# EAGLE design ppm_encoder_402 (EAGLE 5.03)
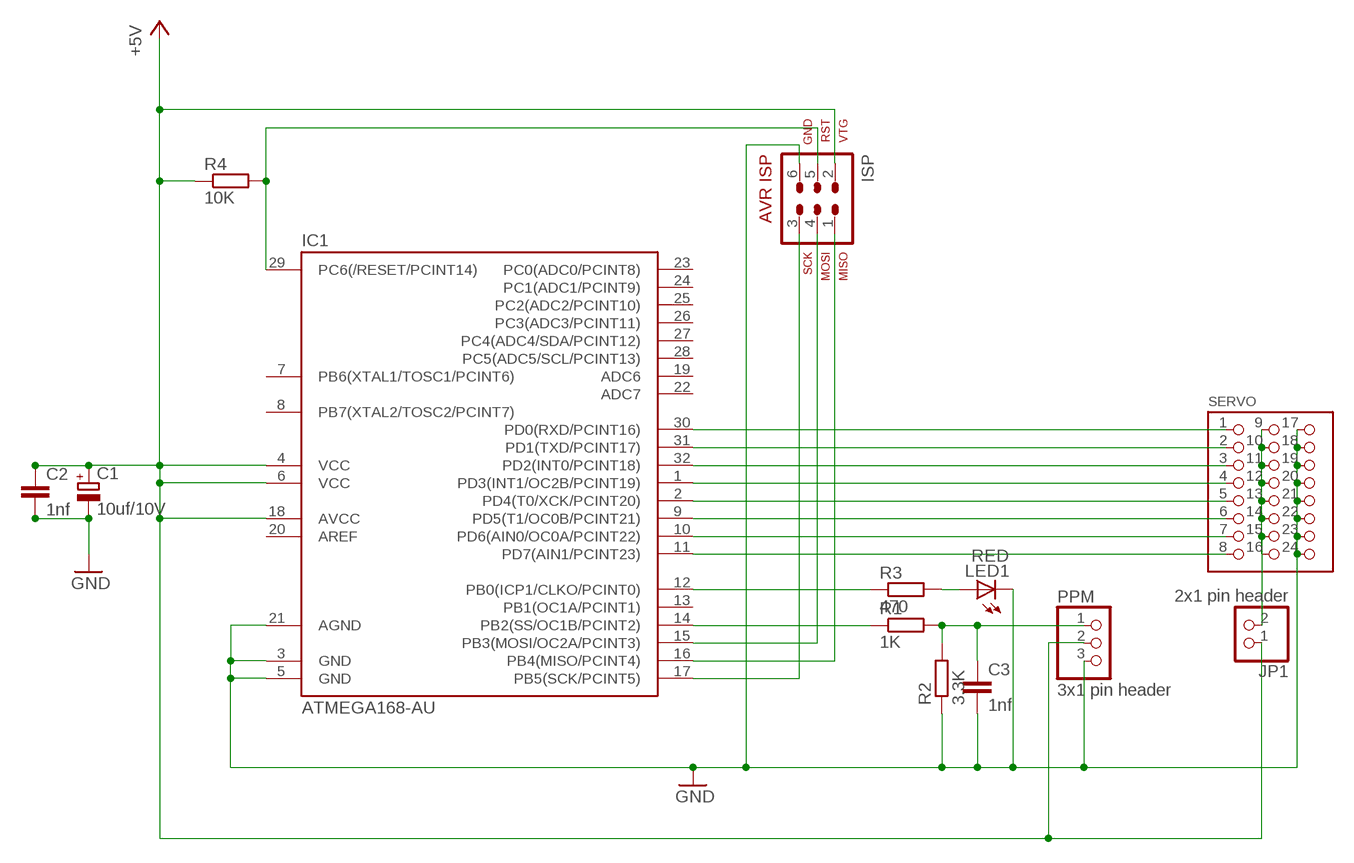
[diagram p0: schematic, sheet 1]

## Parts
C1  10uf/10V  CPOL-EUB/3528-21R  [B/3528-21R]
C2  1nf  C-EUC0402  [C0402]
C3  1nf  C-EUC0402  [C0402]
IC1  ATMEGA168-AU  MEGA48/88/168-AU  [TQFP32-08]
ISP  AVR-ISP-6  [AVR-ISP-6]
JP1  2x1 pin header  PINHD-1X2  [1X02]
LED1  RED  LEDCHIP-LED0603  [CHIP-LED0603]
PPM  3x1 pin header  PINHD-1X3  [1X03]
R1  1K  R-EU_R0402  [R0402]
R2  3.3K  R-EU_R0402  [R0402]
R3  470  R-EU_R0402  [R0402]
R4  10K  R-EU_R0402  [R0402]
SERVO  3x8 pin header  PIN_3X8  [PIN_3X8]

## Nets
+5V: C1.+ C2.1 IC1.4(VCC) IC1.6(VCC) IC1.18(AVCC) ISP.2 JP1.1 PPM.2 R4.1
GND: C1.- C2.2 C3.2 IC1.3(GND) IC1.5(GND) IC1.21(AGND) ISP.6 LED1.C PPM.3 R2.1 SERVO.17 SERVO.18 SERVO.19 SERVO.20 SERVO.21 SERVO.22 SERVO.23 SERVO.24
N$1: IC1.30(PD0(RXD/PCINT16)) SERVO.1
N$2: IC1.31(PD1(TXD/PCINT17)) SERVO.2
N$3: IC1.32(PD2(INT0/PCINT18)) SERVO.3
N$4: IC1.1(PD3(INT1/OC2B/PCINT19)) SERVO.4
N$5: IC1.2(PD4(T0/XCK/PCINT20)) SERVO.5
N$6: IC1.9(PD5(T1/OC0B/PCINT21)) SERVO.6
N$7: IC1.10(PD6(AIN0/OC0A/PCINT22)) SERVO.7
N$8: IC1.11(PD7(AIN1/PCINT23)) SERVO.8
N$9: IC1.12(PB0(ICP1/CLKO/PCINT0)) R3.1
N$10: IC1.14(PB2(SS/OC1B/PCINT2)) R1.1
N$11: C3.1 PPM.1 R1.2 R2.2
N$12: LED1.A R3.2
N$13: IC1.16(PB4(MISO/PCINT4)) ISP.1
N$14: IC1.15(PB3(MOSI/OC2A/PCINT3)) ISP.4
N$15: IC1.17(PB5(SCK/PCINT5)) ISP.3
N$16: IC1.29(PC6(/RESET/PCINT14)) ISP.5 R4.2
N$18: JP1.2 SERVO.9 SERVO.10 SERVO.11 SERVO.12 SERVO.13 SERVO.14 SERVO.15 SERVO.16
Unconnected: IC1.7(PB6(XTAL1/TOSC1/PCINT6)) IC1.8(PB7(XTAL2/TOSC2/PCINT7)) IC1.13(PB1(OC1A/PCINT1)) IC1.19(ADC6) IC1.20(AREF) IC1.22(ADC7) IC1.23(PC0(ADC0/PCINT8)) IC1.24(PC1(ADC1/PCINT9)) IC1.25(PC2(ADC2/PCINT10)) IC1.26(PC3(ADC3/PCINT11)) IC1.27(PC4(ADC4/SDA/PCINT12)) IC1.28(PC5(ADC5/SCL/PCINT13))

## Library data of the parts
C1 = rcl:CPOL-EU: POLARIZED CAPACITOR, European symbol
C2 C3 = rcl:C-EU: CAPACITOR, European symbol
IC1 = avr-4:MEGA48/88/168
ISP = avr-4:AVR-ISP-6: AVR ISP-6 Serial Programming Header
JP1 = pinhead:PINHD-1X2: PIN HEADER
LED1 = led:LED: LED OSRAM: - CHIPLED LG R971, LG N971, LY N971, LG Q971, LY Q971, LO R971, LY R971 LH N974, LH R974 LS Q976, LO Q976, LY Q976 LO Q996 - Hyper CHIPLED LW Q18S LB Q993, LB Q99A, LB R99A - SideLED LS A670, LO A670, LY A670, LG A670, LP A670 LB A673, LV A673, LT A673, LW A673 LH A674 LY A675 LS A676, LA A676, LO A676, LY A676, LW A676 LS A679, LY A679, LG A679 - Hyper Micro SIDELED® LS Y876, LA Y876, LO Y876, LY Y876 LT Y87S - SmartLED LW L88C, LW L88S LB L89C, LB L89S, LG L890 LS L89K, LO L89K, LY L89K LS L896, LA L896, LO L896, LY L896 - TOPLED LS T670, LO T670, LY T670, LG T670, LP T670 LSG T670, LSP T670, LSY T670, LOP T670, LYG T670 LG T671, LOG T671, LSG T671 LB T673, LV T673, LT T673, LW T673 LH T674 LS T676, LA T676, LO T676, LY T676, LB T676, LH T676, LSB T676, LW T676 LB T67C, LV T67C, LT T67C, LS T67K, LO T67K, LY T67K, LW E67C LS E67B, LA E67B, LO E67B, LY E67B, LB E67C, LV E67C, LT E67C LW T67C LS T679, LY T679, LG T679 LS T770, LO T770, LY T770, LG T770, LP T770 LB T773, LV T773, LT T773, LW T773 LH T774 LS E675, LA E675, LY E675, LS T675 LS T776, LA T776, LO T776, LY T776, LB T776 LHGB T686 LT T68C, LB T68C - Hyper Mini TOPLED® LB M676 - Mini TOPLED Santana® LG M470 LS M47K, LO M47K, LY M47K Source: http://www.osram.convergy.de LUXEON: - LUMILED® LXK2-PW12-R00, LXK2-PW12-S00, LXK2-PW14-U00, LXK2-PW14-V00 LXK2-PM12-R00, LXK2-PM12-S00, LXK2-PM14-U00 LXK2-PE12-Q00, LXK2-PE12-R00, LXK2-PE12-S00, LXK2-PE14-T00, LXK2-PE14-U00 LXK2-PB12-K00, LXK2-PB12-L00, LXK2-PB12-M00, LXK2-PB14-N00, LXK2-PB14-P00, LXK2-PB14-Q00 LXK2-PR12-L00, LXK2-PR12-M00, LXK2-PR14-Q00, LXK2-PR14-R00 LXK2-PD12-Q00, LXK2-PD12-R00, LXK2-PD12-S00 LXK2-PH12-R00, LXK2-PH12-S00 LXK2-PL12-P00, LXK2-PL12-Q00, LXK2-PL12-R00 Source: www.luxeon.com KINGBRIGHT: KA-3528ASYC Source: www.kingbright.com
PPM = pinhead:PINHD-1X3: PIN HEADER
R1-R4 = rcl:R-EU_: RESISTOR, European symbol
SERVO = pinhead_3row:PIN_3X8

## Board
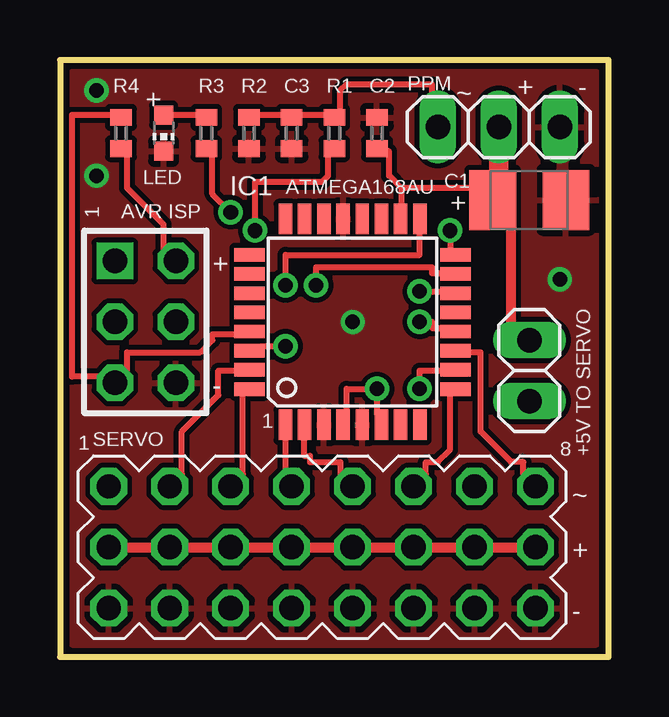
[diagram p1: board, top side]
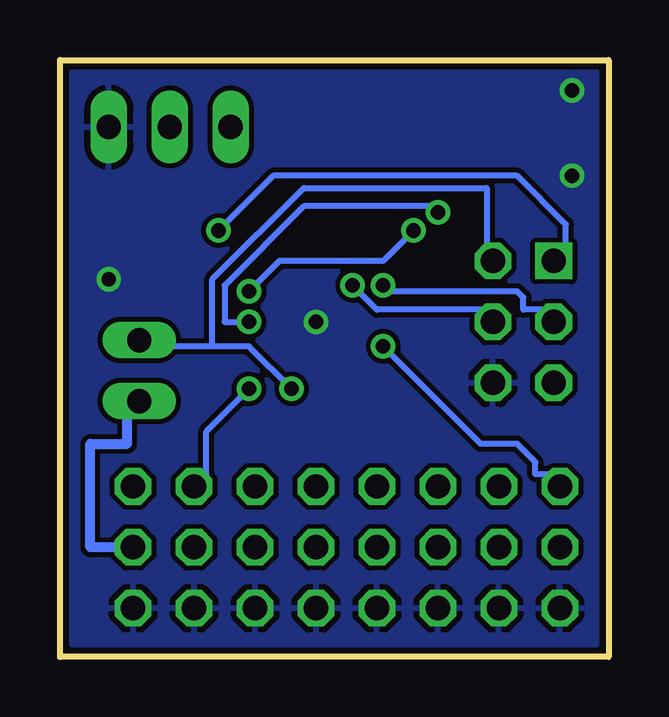
[diagram p2: board, bottom side, seen from below]

Size 22.86 x 24.89 mm. Coordinates in mm from the lower left corner, seen from the top.
Outline: 0,0 22.86,0 22.86,24.89 0,24.89 0,0
Copper layers (1*16): Top 0.035mm / dielectric 1.5mm / Bottom 0.035mm
Design rules "default *": minimum track width 8mil, minimum drill 24mil, track to track 8mil, track to pad 8mil, pad to pad 8mil, via to via 8mil, smd to smd 8mil, copper to edge 8mil, drill to drill 8mil, minimum pad ring 10mil, minimum via ring 8mil, stop-mask expansion 4mil, vias tented up to drill 0mil, thermal gap 10mil

### Footprints (pad centres in the part's own frame; a part is rotated, then mirrored left to right if it is on the bottom)
B/3528-21R = smd 1.95 x 2.5: + 1.525,0; - -1.525,0
C0402 = smd 0.7 x 0.9: 1 -0.65,0; 2 0.65,0
TQFP32-08 = smd 1.27 x 0.559: 1 -4.293,2.8; 2 -4.293,2; 3 -4.293,1.2; 4 -4.293,0.4; 5 -4.293,-0.4; 6 -4.293,-1.2; 7 -4.293,-2; 8 -4.293,-2.8; 17 4.293,-2.8; 18 4.293,-2; 19 4.293,-1.2; 20 4.293,-0.4; 21 4.293,0.4; 22 4.293,1.2; 23 4.293,2; 24 4.293,2.8 | smd 0.559 x 1.27: 9 -2.8,-4.293; 10 -2,-4.293; 11 -1.2,-4.293; 12 -0.4,-4.293; 13 0.4,-4.293; 14 1.2,-4.293; 15 2,-4.293; 16 2.8,-4.293; 25 2.8,4.293; 26 2,4.293; 27 1.2,4.293; 28 0.4,4.293; 29 -0.4,4.293; 30 -1.2,4.293; 31 -2,4.293; 32 -2.8,4.293
AVR-ISP-6 = drill 1.016 square: 1 -2.54,-1.27 | drill 1.016 octagon: 2 -2.54,1.27; 3 0,-1.27; 4 0,1.27; 5 2.54,-1.27; 6 2.54,1.27
1X02 = drill 1.016 long: 1 -1.27,0; 2 1.27,0
CHIP-LED0603 = smd 0.8 x 0.8: A 0,-0.75; C 0,0.75
1X03 = drill 1.016 long: 1 -2.54,0; 2 0,0; 3 2.54,0
R0402 = smd 0.7 x 0.9: 1 -0.65,0; 2 0.65,0
PIN_3X8 = drill 1.016 octagon: 1 1.27,-1.27; 2 3.81,-1.27; 3 6.35,-1.27; 4 8.89,-1.27; 5 11.43,-1.27; 6 13.97,-1.27; 7 16.51,-1.27; 8 19.05,-1.27; 9 1.27,-3.81; 10 3.81,-3.81; 11 6.35,-3.81; 12 8.89,-3.81; 13 11.43,-3.81; 14 13.97,-3.81; 15 16.51,-3.81; 16 19.05,-3.81; 17 1.27,-6.35; 18 3.81,-6.35; 19 6.35,-6.35; 20 8.89,-6.35; 21 11.43,-6.35; 22 13.97,-6.35; 23 16.51,-6.35; 24 19.05,-6.35

### Placement (x,y rotation side)
C1  19.56,19.05 180 top
C2  13.21,21.84 90 top
C3  9.65,21.84 270 top
IC1  12.19,13.97 90 top
ISP  3.56,13.97 270 top
JP1  19.56,11.94 270 top
LED1  4.32,21.84 180 top
PPM  18.29,22.1 0 top
R1  11.43,21.84 90 top
R2  7.87,21.84 90 top
R3  6.1,21.84 90 top
R4  2.54,21.84 90 top
SERVO  0.76,8.38 0 top

### Tracks (layer width: path | path; a pad name or v marks a point on that pad's centre or on a via)
+5V  (via drill 0.61)
  Top 0.254: 14.22,19.56 13.72,20.07 13.72,21.08 13.46,21.08 C2.1 | 14.22,19.56 14.22,18.8 IC1.18 | 14.22,19.56 17.27,19.56 C1.+ | C1.+ 18.29,20.07 | R4.1 2.79,21.08 2.79,19.56 4.32,18.03 4.32,17.02 ISP.2 | IC1.4 11.94,10.16 11.94,11.18 v13.21,11.18 13.21,10.16 IC1.6 | 18.8,18.03 C1.+ | JP1.1 18.8,13.72
  Top 0.406: 18.8,13.72 18.8,18.03
  Top 0.813: 18.29,20.07 PPM.2
  Bottom 0.254: v13.21,11.18 14.99,12.95 16.51,12.95 | 16.51,12.95 18.29,12.95 JP1.1 | 16.51,12.95 16.51,15.75 12.7,19.56 5.08,19.56 5.08,17.02 ISP.2
GND  (via drill 0.6)
  other vias: 1.52,20.07 12.19,13.97 20.83,15.75 1.52,23.62
  pour Top: 0.51,24.38 0.51,0.51 22.35,0.51 22.35,24.38
  pour Bottom: 0.51,24.38 0.51,0.51 22.35,0.51 22.35,24.38
N$1  (via drill 0.61)
  Top 0.254: v9.4,12.95 8.38,12.95 IC1.30
  Bottom 0.254: v9.4,12.95 5.33,8.89 3.81,8.89 3.05,8.13 3.05,7.62 2.54,7.62 SERVO.1
N$2
  Top 0.254: IC1.31 7.37,11.94 6.6,11.94 6.6,10.92 5.08,9.4 5.08,7.62 SERVO.2
N$3
  Top 0.254: IC1.32 7.62,10.92 7.62,7.62 SERVO.3
N$4
  Top 0.254: IC1.1 9.4,9.14 9.4,7.62 SERVO.4
N$5
  Top 0.254: IC1.2 10.16,9.14 10.16,8.38 10.41,8.38 10.41,8.13 11.68,8.13 11.68,7.62 SERVO.5
N$6
  Top 0.254: IC1.9 16.26,10.92 16.26,8.64 15.75,8.13 15.24,8.13 15.24,7.62 SERVO.6
N$7  (via drill 0.61)
  Top 0.254: v14.99,11.18 14.99,11.94 16,11.94 IC1.10
  Bottom 0.254: v14.99,11.18 16.76,9.4 16.76,7.62 SERVO.7
N$8
  Top 0.254: IC1.11 17.02,12.7 17.53,12.7 17.53,9.4 18.8,8.13 19.3,8.13 19.3,7.62 SERVO.8
N$9  (via drill 0.61)
  Top 0.254: v7.11,18.54 6.35,19.3 6.35,21.08 R3.1 | v14.99,13.97 15.49,13.97 15.49,13.72 16,13.72 IC1.12
  Bottom 0.254: v7.11,18.54 7.37,18.8 12.7,18.8 16,15.49 16,13.97 v14.99,13.97
N$10  (via drill 0.61)
  Top 0.254: v8.13,17.78 8.13,19.81 10.92,19.81 11.18,20.07 11.18,21.08 R1.1 | v14.99,15.24 16,15.24 IC1.14
  Bottom 0.254: v8.13,17.78 9.4,16.51 13.72,16.51 v14.99,15.24
N$11
  Top 0.254: R2.2 8.13,22.61 9.4,22.61 C3.1 9.91,22.61 11.18,22.61 R1.2 11.68,22.61 11.68,23.62 11.94,23.88 15.49,23.88 15.49,23.37 PPM.1
N$12
  Top 0.254: LED1.A 4.57,22.61 5.84,22.61 R3.2
N$13  (via drill 0.61)
  Top 0.254: v16.26,17.78 16.26,17.02 IC1.16
  Bottom 0.254: v16.26,17.78 13.97,20.07 3.81,20.07 1.78,18.03 1.78,17.02 ISP.1
N$14  (via drill 0.61)
  Top 0.254: v10.67,15.49 10.67,16.26 15.49,16.26 15.49,16 16,16 IC1.15
  Bottom 0.254: v10.67,15.49 9.65,14.48 5.33,14.48 ISP.4
N$15  (via drill 0.61)
  Top 0.254: v9.4,15.49 9.4,16.76 14.99,16.76 14.99,17.78 IC1.17
  Bottom 0.254: v9.4,15.49 9.14,15.24 3.81,15.24 3.56,14.99 3.56,14.48 2.79,14.48 ISP.3
N$16
  Top 0.254: R4.2 2.29,22.61 0.51,22.61 0.51,11.68 1.78,11.68 ISP.5 2.79,11.94 2.79,12.7 5.84,12.7 6.35,13.21 6.35,13.46 7.37,13.46 IC1.29
N$18
  Top 0.254: 9.4,4.57 SERVO.12
  Top 0.406: SERVO.16 SERVO.15 SERVO.14 SERVO.13 SERVO.12 | SERVO.9 SERVO.10 SERVO.11 9.4,4.57
  Bottom 0.406: JP1.2 20.07,10.16 20.07,8.89 21.59,8.89 21.59,4.57 SERVO.16

### Text on the board
tNames: R4 | R3 | R2 | C3 | R1 | C2 | PPM | + | ~ | + | - | LED | 1 | ATMEGA168AU | C1 | AVR ISP | + | + | - | 1 | 1 | SERVO | 8 | +5V TO SERVO | ~ | + | -